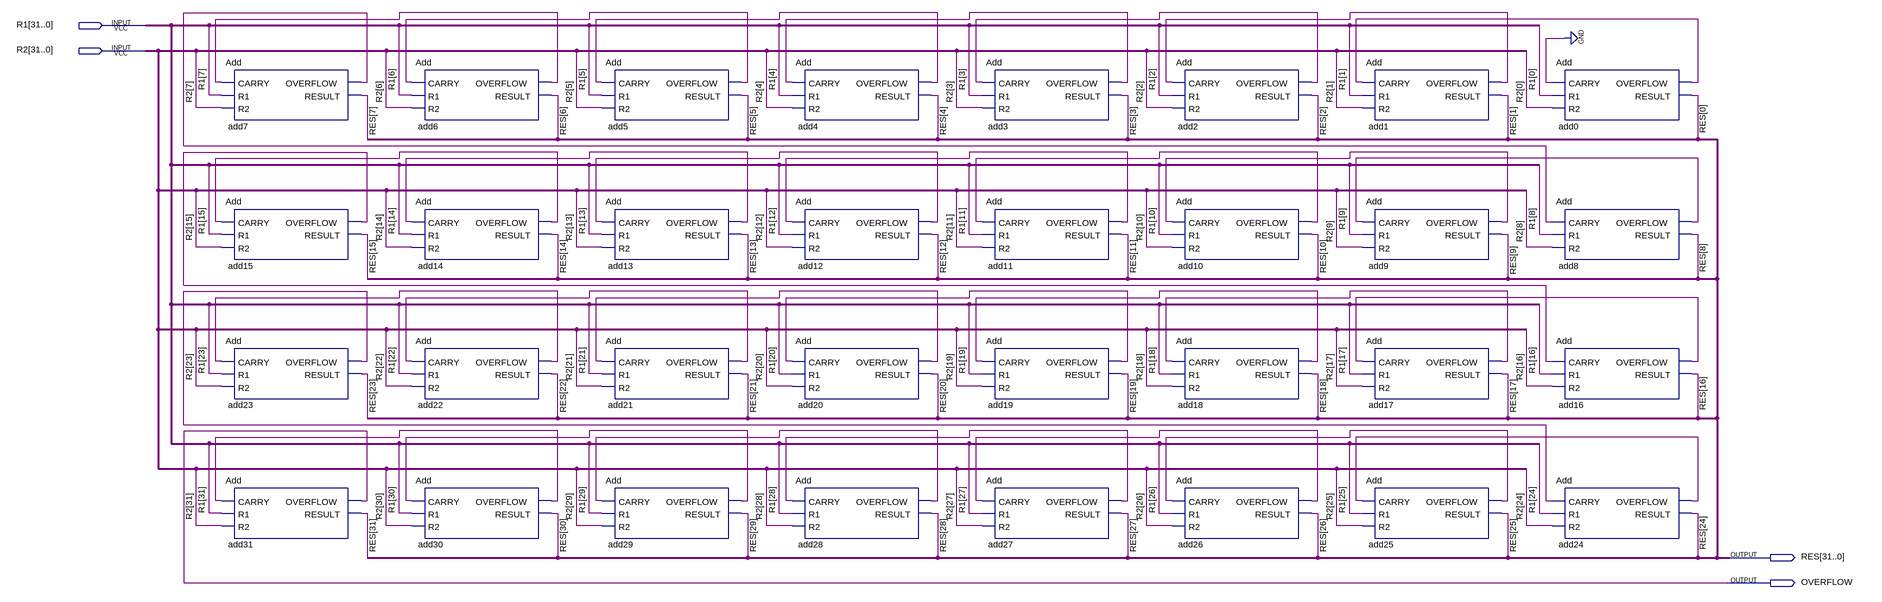
[diagram p0: schematic sheet]
// Quartus schematic Add32.bdf as structural Verilog: 32 symbols, 4 pins
module Add32 (
  input  [31:0] R1,
  input  [31:0] R2,
  output [31:0] RES,
  output OVERFLOW
);

  wire add0_overflow, add1_overflow, add2_overflow, add3_overflow, add4_overflow, add5_overflow,
       add6_overflow, add7_overflow, add8_overflow, add9_overflow, add10_overflow, add11_overflow,
       add12_overflow, add13_overflow, add14_overflow, add15_overflow, add16_overflow, add17_overflow,
       add18_overflow, add19_overflow, add20_overflow, add21_overflow, add22_overflow, add23_overflow,
       add24_overflow, add25_overflow, add26_overflow, add27_overflow, add28_overflow, add29_overflow,
       add30_overflow;

  Add add7 (.CARRY(add6_overflow), .R1(R1[7]), .R2(R2[7]), .OVERFLOW(add7_overflow), .RESULT(RES[7]));
  Add add15 (.CARRY(add14_overflow), .R1(R1[15]), .R2(R2[15]), .OVERFLOW(add15_overflow), .RESULT(RES[15]));
  Add add23 (.CARRY(add22_overflow), .R1(R1[23]), .R2(R2[23]), .OVERFLOW(add23_overflow), .RESULT(RES[23]));
  Add add31 (.CARRY(add30_overflow), .R1(R1[31]), .R2(R2[31]), .OVERFLOW(OVERFLOW), .RESULT(RES[31]));
  Add add6 (.CARRY(add5_overflow), .R1(R1[6]), .R2(R2[6]), .OVERFLOW(add6_overflow), .RESULT(RES[6]));
  Add add14 (.CARRY(add13_overflow), .R1(R1[14]), .R2(R2[14]), .OVERFLOW(add14_overflow), .RESULT(RES[14]));
  Add add22 (.CARRY(add21_overflow), .R1(R1[22]), .R2(R2[22]), .OVERFLOW(add22_overflow), .RESULT(RES[22]));
  Add add30 (.CARRY(add29_overflow), .R1(R1[30]), .R2(R2[30]), .OVERFLOW(add30_overflow), .RESULT(RES[30]));
  Add add5 (.CARRY(add4_overflow), .R1(R1[5]), .R2(R2[5]), .OVERFLOW(add5_overflow), .RESULT(RES[5]));
  Add add13 (.CARRY(add12_overflow), .R1(R1[13]), .R2(R2[13]), .OVERFLOW(add13_overflow), .RESULT(RES[13]));
  Add add21 (.CARRY(add20_overflow), .R1(R1[21]), .R2(R2[21]), .OVERFLOW(add21_overflow), .RESULT(RES[21]));
  Add add29 (.CARRY(add28_overflow), .R1(R1[29]), .R2(R2[29]), .OVERFLOW(add29_overflow), .RESULT(RES[29]));
  Add add4 (.CARRY(add3_overflow), .R1(R1[4]), .R2(R2[4]), .OVERFLOW(add4_overflow), .RESULT(RES[4]));
  Add add12 (.CARRY(add11_overflow), .R1(R1[12]), .R2(R2[12]), .OVERFLOW(add12_overflow), .RESULT(RES[12]));
  Add add20 (.CARRY(add19_overflow), .R1(R1[20]), .R2(R2[20]), .OVERFLOW(add20_overflow), .RESULT(RES[20]));
  Add add28 (.CARRY(add27_overflow), .R1(R1[28]), .R2(R2[28]), .OVERFLOW(add28_overflow), .RESULT(RES[28]));
  Add add3 (.CARRY(add2_overflow), .R1(R1[3]), .R2(R2[3]), .OVERFLOW(add3_overflow), .RESULT(RES[3]));
  Add add11 (.CARRY(add10_overflow), .R1(R1[11]), .R2(R2[11]), .OVERFLOW(add11_overflow), .RESULT(RES[11]));
  Add add19 (.CARRY(add18_overflow), .R1(R1[19]), .R2(R2[19]), .OVERFLOW(add19_overflow), .RESULT(RES[19]));
  Add add27 (.CARRY(add26_overflow), .R1(R1[27]), .R2(R2[27]), .OVERFLOW(add27_overflow), .RESULT(RES[27]));
  Add add2 (.CARRY(add1_overflow), .R1(R1[2]), .R2(R2[2]), .OVERFLOW(add2_overflow), .RESULT(RES[2]));
  Add add10 (.CARRY(add9_overflow), .R1(R1[10]), .R2(R2[10]), .OVERFLOW(add10_overflow), .RESULT(RES[10]));
  Add add18 (.CARRY(add17_overflow), .R1(R1[18]), .R2(R2[18]), .OVERFLOW(add18_overflow), .RESULT(RES[18]));
  Add add26 (.CARRY(add25_overflow), .R1(R1[26]), .R2(R2[26]), .OVERFLOW(add26_overflow), .RESULT(RES[26]));
  Add add1 (.CARRY(add0_overflow), .R1(R1[1]), .R2(R2[1]), .OVERFLOW(add1_overflow), .RESULT(RES[1]));
  Add add9 (.CARRY(add8_overflow), .R1(R1[9]), .R2(R2[9]), .OVERFLOW(add9_overflow), .RESULT(RES[9]));
  Add add17 (.CARRY(add16_overflow), .R1(R1[17]), .R2(R2[17]), .OVERFLOW(add17_overflow), .RESULT(RES[17]));
  Add add25 (.CARRY(add24_overflow), .R1(R1[25]), .R2(R2[25]), .OVERFLOW(add25_overflow), .RESULT(RES[25]));
  Add add0 (.CARRY(1'b0), .R1(R1[0]), .R2(R2[0]), .OVERFLOW(add0_overflow), .RESULT(RES[0]));
  Add add8 (.CARRY(add7_overflow), .R1(R1[8]), .R2(R2[8]), .OVERFLOW(add8_overflow), .RESULT(RES[8]));
  Add add16 (.CARRY(add15_overflow), .R1(R1[16]), .R2(R2[16]), .OVERFLOW(add16_overflow), .RESULT(RES[16]));
  Add add24 (.CARRY(add23_overflow), .R1(R1[24]), .R2(R2[24]), .OVERFLOW(add24_overflow), .RESULT(RES[24]));
endmodule
